# Altium schematic sheet nRF24L01_SMA.SchDoc: nRF24L01 Sparrow Module
size A3; DocumentNumber: 1; Revision: 1.0; SheetNumber: 0; SheetTotal: 0
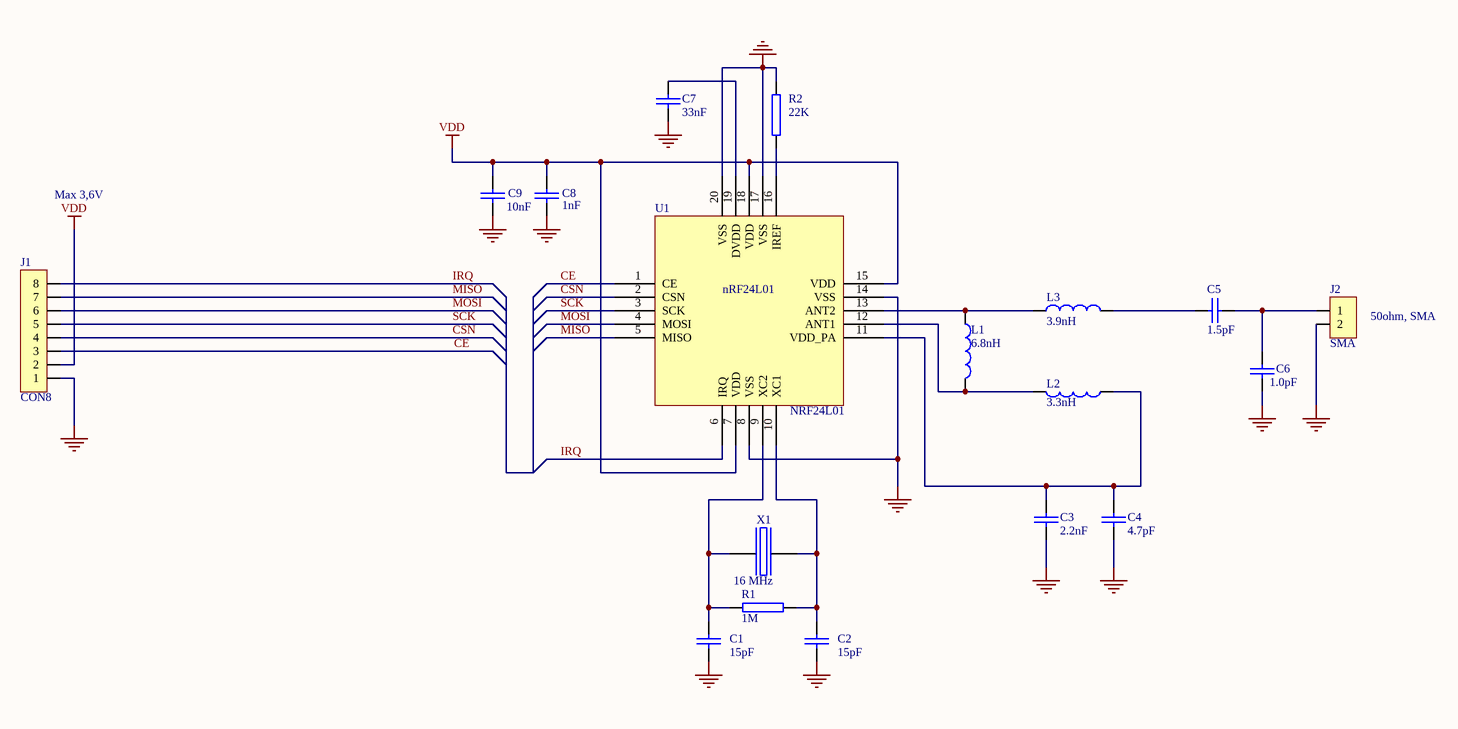
[diagram p0: nRF24L01_SMA.SchDoc]

## Parts
C1  15pF  [0402s]
C2  15pF  [0402s]
C3  2.2nF  [0402s]
C4  4.7pF  [0402s]
C5  1.5pF  [0402s]
C6  1.0pF  [0402s]
C7  33nF  [0402s]
C8  1nF  [0402s]
C9  10nF  [0402s]
J1  CON8
J2  SMA  [SMA_H]
L1  6.8nH  [0402s]
L2  3.3nH  [0402s]
L3  3.9nH  [0402s]
R1  1M  [0402s]
R2  22K  [0402s]
U1  NRF24L01  [QFN20L/5x5]
X1  16 MHz  [BT-XTAL]

## Nets
GND: C1.2 C2.1 C3.1 C4.1 C6.2 C7.2 C8.2 C9.2 J1.1 J2.2 R2.2 U1.8(VSS) U1.14(VSS) U1.17(VSS) U1.20(VSS)
VDD: C8.1 C9.1 J1.2 U1.7(VDD) U1.15(VDD) U1.18(VDD)
VSS: X1.2(VSS) X1.4(VSS)
CE: J1.3 U1.1(CE)
CSN: J1.4 U1.2(CSN)
IRQ: J1.8 U1.6(IRQ)
MISO: J1.7 U1.5(MISO)
MOSI: J1.6 U1.4(MOSI)
SCK: J1.5 U1.3(SCK)
NetC1_1: C1.1 R1.1 U1.9(XC2) X1.1(inp)
NetC2_2: C2.2 R1.2 U1.10(XC1) X1.3(out)
NetC3_2: C3.2 C4.2 L2.1 U1.11(VDD_PA)
NetC5_1: C5.1 C6.1 J2.1
NetC5_2: C5.2 L3.2
NetC7_1: C7.1 U1.19(DVDD)
NetL1_1: L1.1 L3.1 U1.13(ANT2)
NetL1_2: L1.2 L2.2 U1.12(ANT1)
NetR2_1: R2.1 U1.16(IREF)

## Notes on the sheet
- Max 3,6V
- (near J2) 50ohm, SMA
- Title
- Size
- Date:
- Number
- Sheet         of
- Revision
- File:
- Drawn By:
- (in symbol NRF24L01) nRF24L01

## Library data of the parts
C1-C9 = CAP: Part Field 1: 0402
J2 = CON2
L1-L3 = INDUCTOR1: Part Field 1: 0402
R1 R2 = RES2: Part Field 1: 0402
U1 = NRF24L01: Part Field 1: 0603
X1 = BT-XTAL: Part Field 1: 0603